# EAGLE design eTapper1main44 (EAGLE 8.4.3)
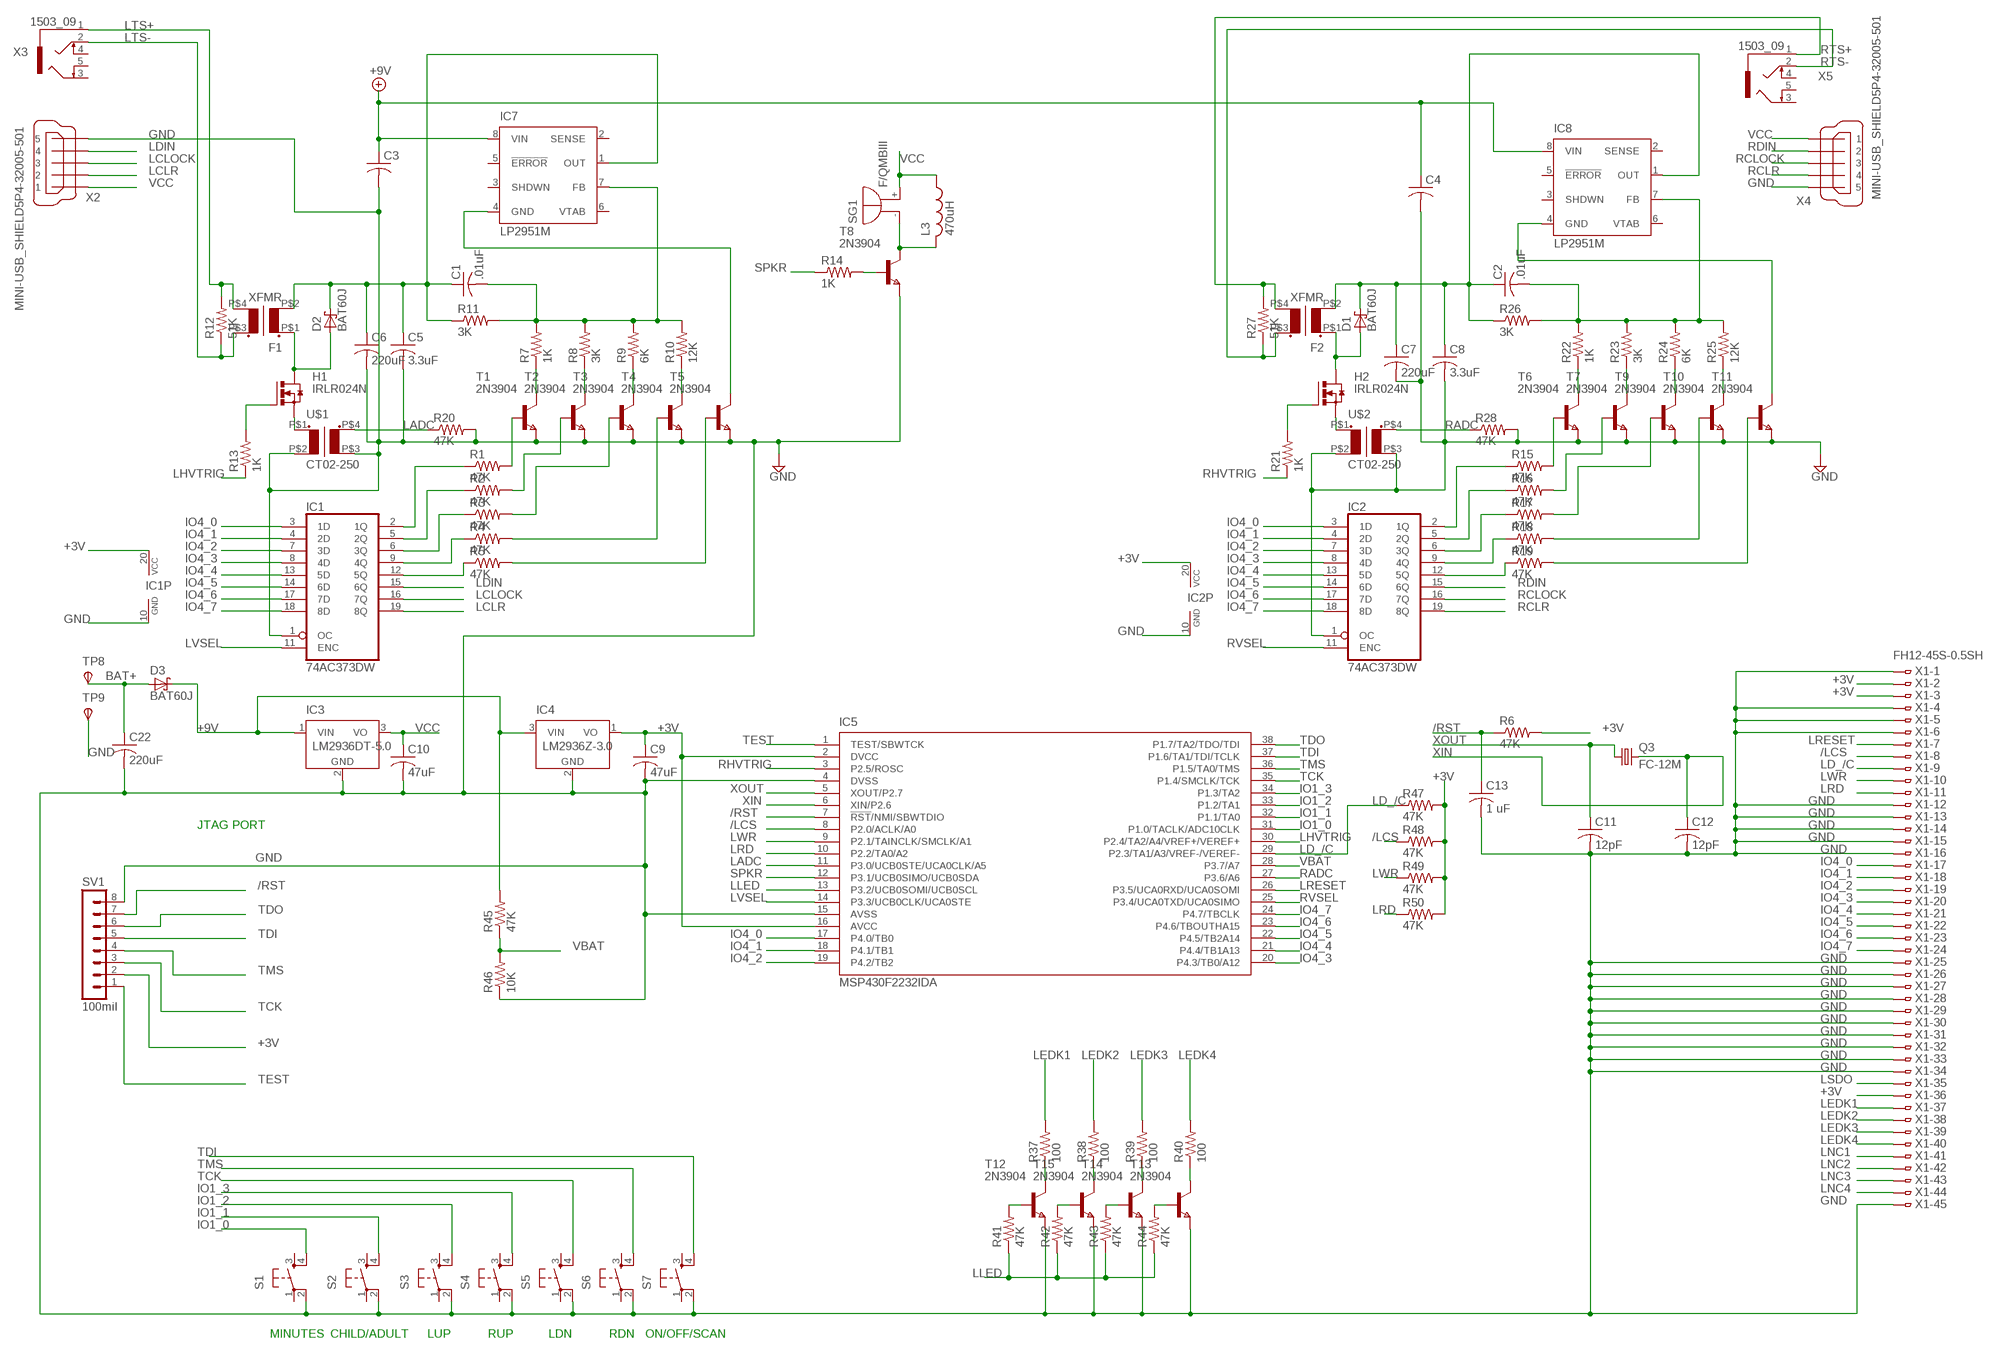
[diagram p0: schematic, sheet 1]

## Parts
C1  .01uF  C-USC0805  [C0805]
C2  .01uF  C-USC0805  [C0805]
C3  C-USC1206  [C1206]
C4  C-USC1206  [C1206]
C5  3.3uF  C-USC0805  [C0805]
C6  220uF  C-USC1206  [C1206]
C7  220uF  C-USC1206  [C1206]
C8  3.3uF  C-USC0805  [C0805]
C9  47uF  C-USC1206  [C1206]
C10  47uF  C-USC1206  [C1206]
C11  12pF  C-USC0805  [C0805]
C12  12pF  C-USC0805  [C0805]
C13  1 uF  C-USC0805  [C0805]
C22  220uF  C-USC1206  [C1206]
D1  BAT60J  [SOD323_ST]
D2  BAT60J  [SOD323_ST]
D3  BAT60J  [SOD323_ST]
F1  XFMR  [XFMR]
F2  XFMR  [XFMR]
H1  IRLR024N  [D-PAK_TO252AA]
H2  IRLR024N  [D-PAK_TO252AA]
IC1  74AC373DW  [SO20W]
IC2  74AC373DW  [SO20W]
IC3  LM2936DT-5.0  [TO252]
IC4  LM2936Z-3.0  [TO92]
IC5  MSP430F2232IDA  [TSSOP38_R-PDSO-G38-DA]
IC7  LP2951M  [SO08]
IC8  LP2951M  [SO08]
L3  470uH  L-USL2825P  [L2825P]
Q3  FC-12M  [FC-12M]
R1  47K  R-US_R0402  [R0402]
R2  47K  R-US_R0402  [R0402]
R3  47K  R-US_R0402  [R0402]
R4  47K  R-US_R0402  [R0402]
R5  47K  R-US_R0402  [R0402]
R6  47K  R-US_R0402  [R0402]
R7  1K  R-US_R0402  [R0402]
R8  3K  R-US_R0402  [R0402]
R9  6K  R-US_R0402  [R0402]
R10  12K  R-US_R0402  [R0402]
R11  3K  R-US_R0402  [R0402]
R12  51K  R-US_R0402  [R0402]
R13  1K  R-US_R0402  [R0402]
R14  1K  R-US_R0402  [R0402]
R15  47K  R-US_R0402  [R0402]
R16  47K  R-US_R0402  [R0402]
R17  47K  R-US_R0402  [R0402]
R18  47K  R-US_R0402  [R0402]
R19  47K  R-US_R0402  [R0402]
R20  47K  R-US_R0402  [R0402]
R21  1K  R-US_R0402  [R0402]
R22  1K  R-US_R0402  [R0402]
R23  3K  R-US_R0402  [R0402]
R24  6K  R-US_R0402  [R0402]
R25  12K  R-US_R0402  [R0402]
R26  3K  R-US_R0402  [R0402]
R27  51K  R-US_R0402  [R0402]
R28  47K  R-US_R0402  [R0402]
R37  100  R-US_R0402  [R0402]
R38  100  R-US_R0402  [R0402]
R39  100  R-US_R0402  [R0402]
R40  100  R-US_R0402  [R0402]
R41  47K  R-US_R0402  [R0402]
R42  47K  R-US_R0402  [R0402]
R43  47K  R-US_R0402  [R0402]
R44  47K  R-US_R0402  [R0402]
R45  47K  R-US_R0402  [R0402]
R46  10K  R-US_R0402  [R0402]
R47  47K  R-US_R0402  [R0402]
R48  47K  R-US_R0402  [R0402]
R49  47K  R-US_R0402  [R0402]
R50  47K  R-US_R0402  [R0402]
S1  10-XX  [B3F-10XX]
S2  10-XX  [B3F-10XX]
S3  10-XX  [B3F-10XX]
S4  10-XX  [B3F-10XX]
S5  10-XX  [B3F-10XX]
S6  10-XX  [B3F-10XX]
S7  10-XX  [B3F-10XX]
SG1  F/QMBIII  [F/QMBIII]
SV1  100mil  MA08-1  [MA08-1]
T1  2N3904  NPNSOT23  [SOT-23]
T2  2N3904  NPNSOT23  [SOT-23]
T3  2N3904  NPNSOT23  [SOT-23]
T4  2N3904  NPNSOT23  [SOT-23]
T5  2N3904  NPNSOT23  [SOT-23]
T6  2N3904  NPNSOT23  [SOT-23]
T7  2N3904  NPNSOT23  [SOT-23]
T8  2N3904  NPNSOT23  [SOT-23]
T9  2N3904  NPNSOT23  [SOT-23]
T10  2N3904  NPNSOT23  [SOT-23]
T11  2N3904  NPNSOT23  [SOT-23]
T12  2N3904  NPNSOT23  [SOT-23]
T13  2N3904  NPNSOT23  [SOT-23]
T14  2N3904  NPNSOT23  [SOT-23]
T15  2N3904  NPNSOT23  [SOT-23]
TP8  TPSPAD1-20  [P1-20]
TP9  TPSPAD1-20  [P1-20]
U$1  CT02-250  [CT02-250]
U$2  CT02-250  [CT02-250]
X1  FH12-45S-0.5SH  [FH12-45S-0.5SH]
X2  MINI-USB_SHIELD5P4-32005-501  [32005-501]
X3  1503_09  [1503_09]
X4  MINI-USB_SHIELD5P4-32005-501  [32005-501]
X5  1503_09  [1503_09]

## Nets
+3V [+3V]: C9.1 IC1.20(VCC) IC2.20(VCC) IC4.1(VO) IC5.2(DVCC) IC5.16(AVCC) R6.2 R47.2 R48.2 R49.2 R50.2 SV1.2 X1.2 X1.3 X1.36
+9V [+9V]: C3.1 C4.1 D3.C IC3.1(VIN) IC4.3(VIN) IC7.8(VIN) IC8.8(VIN) R45.2
/LCS: IC5.8(P2.0/ACLK/A0) R48.1 X1.8
/RST: C13.1 IC5.7(!RST!/NMI/SBWTDIO) R6.1 SV1.7
BAT+ [BAT+]: C22.1 D3.A TP8.TP(PP)
GND [GND]: C3.2 C4.2 C5.2 C6.2 C7.2 C8.2 C9.2 C10.2 C11.2 C12.2 C13.2 C22.2 IC1.1(OC) IC1.10(GND) IC2.1(OC) IC2.10(GND) IC3.2(GND) IC4.2(GND) IC5.4(DVSS) IC5.15(AVSS) R20.2 R28.2 R46.1 S1.2(P1) S2.2(P1) S3.2(P1) S4.2(P1) S5.2(P1) S6.2(P1) S7.2(P1) SV1.8 T1.2(E) T2.2(E) T3.2(E) T4.2(E) T5.2(E) T6.2(E) T7.2(E) T8.2(E) T9.2(E) T10.2(E) T11.2(E) T12.2(E) T13.2(E) T14.2(E) T15.2(E) TP9.TP(PP) U$1.P$2(P2) U$1.P$3(S2) U$2.P$2(P2) U$2.P$3(S2) X1.1 X1.4 X1.5 X1.6 X1.12 X1.13 X1.14 X1.15 X1.16 X1.25 X1.26 X1.27 X1.28 X1.29 X1.30 X1.31 X1.32 X1.33 X1.34 X1.45 X2.5 X4.5
IO1_0: IC5.31(P1.0/TACLK/ADC10CLK) S1.4(S1)
IO1_1: IC5.32(P1.1/TA0) S2.4(S1)
IO1_2: IC5.33(P1.2/TA1) S3.4(S1)
IO1_3: IC5.34(P1.3/TA2) S4.4(S1)
IO4_0: IC1.3(1D) IC2.3(1D) IC5.17(P4.0/TB0) X1.17
IO4_1: IC1.4(2D) IC2.4(2D) IC5.18(P4.1/TB1) X1.18
IO4_2: IC1.7(3D) IC2.7(3D) IC5.19(P4.2/TB2) X1.19
IO4_3: IC1.8(4D) IC2.8(4D) IC5.20(P4.3/TB0/A12) X1.20
IO4_4: IC1.13(5D) IC2.13(5D) IC5.21(P4.4/TB1A13) X1.21
IO4_5: IC1.14(6D) IC2.14(6D) IC5.22(P4.5/TB2A14) X1.22
IO4_6: IC1.17(7D) IC2.17(7D) IC5.23(P4.6/TBOUTHA15) X1.23
IO4_7: IC1.18(8D) IC2.18(8D) IC5.24(P4.7/TBCLK) X1.24
LADC: IC5.11(P3.0/UCB0STE/UCA0CLK/A5) R20.1 U$1.P$4(S1)
LCLOCK: IC1.16(7Q) X2.3
LCLR: IC1.19(8Q) X2.2
LD_/C: IC5.29(P2.3/TA1/A3/VREF-/VEREF-) R47.1 X1.9
LDIN: IC1.15(6Q) X2.4
LEDK1: R37.2 X1.37
LEDK2: R38.2 X1.38
LEDK3: R39.2 X1.39
LEDK4: R40.2 X1.40
LHVTRIG: IC5.30(P2.4/TA2/A4/VREF+/VEREF+) R13.1
LLED: IC5.13(P3.2/UCB0SOMI/UCB0SCL) R41.1 R42.1 R43.1 R44.1
LNC1: X1.41
LNC2: X1.42
LNC3: X1.43
LNC4: X1.44
LRD: IC5.10(P2.2/TA0/A2) R50.1 X1.11
LRESET: IC5.26(P3.5/UCA0RXD/UCA0SOMI) X1.7
LSDO: X1.35
LTS+: F1.P$4(S2) R12.2 X3.1
LTS-: F1.P$3(S1) R12.1 X3.2
LVSEL: IC1.11(ENC) IC5.14(P3.3/UCB0CLK/UCA0STE)
LWR: IC5.9(P2.1/TAINCLK/SMCLK/A1) R49.1 X1.10
N$1: IC1.2(1Q) R1.1
N$2: IC1.5(2Q) R2.1
N$3: IC1.6(3Q) R3.1
N$4: IC1.9(4Q) R4.1
N$5: IC1.12(5Q) R5.1
N$6: L3.2 SG1.-(+) T8.1(C)
N$7: R4.2 T4.3(B)
N$8: R5.2 T5.3(B)
N$9: D2.A F1.P$1(P1) H1.4(D)
N$10: R7.1 T1.1(C)
N$11: R8.1 T2.1(C)
N$12: R9.1 T3.1(C)
N$13: R1.2 T1.3(B)
N$14: R2.2 T2.3(B)
N$15: R3.2 T3.3(B)
N$16: R10.1 T4.1(C)
N$17: C1.2 IC7.7(FB) R7.2 R8.2 R9.2 R10.2 R11.2
N$18: C1.1 C5.1 C6.1 D2.C F1.P$2(P2) IC7.1(OUT) R11.1
N$19: D1.A F2.P$1(P1) H2.4(D)
N$20: IC2.2(1Q) R15.1
N$21: H1.1(G) R13.2
N$22: R14.2 T8.3(B)
N$23 [GND]: H1.3(S) U$1.P$1(P1)
N$24: IC2.5(2Q) R16.1
N$25: IC2.6(3Q) R17.1
N$26: IC2.9(4Q) R18.1
N$27: IC2.12(5Q) R19.1
N$28: R44.2 T13.3(B)
N$29: R15.2 T6.3(B)
N$30: R16.2 T7.3(B)
N$31: R17.2 T9.3(B)
N$32: R18.2 T10.3(B)
N$33: R19.2 T11.3(B)
N$35: R22.1 T6.1(C)
N$36: R23.1 T7.1(C)
N$37: R24.1 T9.1(C)
N$38: R25.1 T10.1(C)
N$39: C2.2 IC8.7(FB) R22.2 R23.2 R24.2 R25.2 R26.2
N$40: C2.1 C7.1 C8.1 D1.C F2.P$2(P2) IC8.1(OUT) R26.1
N$41: R37.1 T12.1(C)
N$42: H2.1(G) R21.2
N$43: R38.1 T15.1(C)
N$44: R39.1 T14.1(C)
N$45: IC7.4(GND) T5.1(C)
N$46: R40.1 T13.1(C)
N$47: IC8.4(GND) T11.1(C)
N$48: R43.2 T14.3(B)
N$49: R41.2 T12.3(B)
N$50: R42.2 T15.3(B)
N$51 [GND]: H2.3(S) U$2.P$1(P1)
RADC: IC5.27(P3.6/A6) R28.1 U$2.P$4(S1)
RCLOCK: IC2.16(7Q) X4.3
RCLR: IC2.19(8Q) X4.4
RDIN: IC2.15(6Q) X4.2
RHVTRIG: IC5.3(P2.5/ROSC) R21.1
RTS+: F2.P$4(S2) R27.2 X5.1
RTS-: F2.P$3(S1) R27.1 X5.2
RVSEL: IC2.11(ENC) IC5.25(P3.4/UCA0TXD/UCA0SIMO)
SPKR: IC5.12(P3.1/UCB0SIMO/UCB0SDA) R14.1
TCK: IC5.35(P1.4/SMCLK/TCK) S5.4(S1) SV1.3
TDI: IC5.37(P1.6/TA1/TDI/TCLK) S7.4(S1) SV1.5
TDO: IC5.38(P1.7/TA2/TDO/TDI) SV1.6
TEST: IC5.1(TEST/SBWTCK) SV1.1
TMS: IC5.36(P1.5/TA0/TMS) S6.4(S1) SV1.4
VBAT: IC5.28(P3.7/A7) R45.1 R46.2
VCC [VCC]: C10.1 IC3.3(VO) L3.1 SG1.+(-) X2.1 X4.1
XIN: C12.1 IC5.6(XIN/P2.6) Q3.2
XOUT: C11.1 IC5.5(XOUT/P2.7) Q3.1
Unconnected: IC7.2(SENSE) IC7.3(SHDWN) IC7.5(!ERROR) IC7.6(VTAB) IC8.2(SENSE) IC8.3(SHDWN) IC8.5(!ERROR) IC8.6(VTAB) S1.1(P) S1.3(S) S2.1(P) S2.3(S) S3.1(P) S3.3(S) S4.1(P) S4.3(S) S5.1(P) S5.3(S) S6.1(P) S6.3(S) S7.1(P) S7.3(S) X2.M1(S1) X2.M2(S2) X2.M3(S3) X2.M4(S4) X3.3 X3.4 X3.5 X4.M1(S1) X4.M2(S2) X4.M3(S3) X4.M4(S4) X5.3 X5.4 X5.5

## Notes on the sheet
- JTAG PORT
- MINUTES | CHILD/ADULT | LUP | RUP | LDN | RDN | ON/OFF/SCAN

## Library data of the parts
C1-C13 C22 = rcl:C-US: CAPACITOR, American symbol
D1-D3 = diode:BAT60J: Schottky barrier diode Source: www.st.com, BAT60J.pdf
F1 F2 = XFMR1:XFMR: Transformer 1"X1" 0.4"X0.4" hole separation for e_tapper
H1 H2 = IRLR024N:IRLR024N: IRLR024N HEXFET Power Mosfet N channel Infeneon Technology TO-251AA IPAK
IC1 IC2 = 74xx-eu:74*373: Octal D type transparent LATCH, edge triggered
IC3 = national-semiconductor:LM2936?*: Ultra-Low Quiescent Current LDO Voltage Regulator Source: Data sheet <http://www.national.com/ds/LM/LM2936.pdf>; MF: NATIONAL SEMICONDUCTOR; MPN: LM2936DT-5.0/NOPB; OC_FARNELL: 1286864; OC_NEWARK: 41K4501
IC4 = national-semiconductor:LM2936?*: Ultra-Low Quiescent Current LDO Voltage Regulator Source: Data sheet <http://www.national.com/ds/LM/LM2936.pdf>; MF: NATIONAL SEMICONDUCTOR; MPN: LM2936Z-3.0/NOPB; OC_FARNELL: 1312709; OC_NEWARK: 41K4531
IC5 = texas:MSP430F22*2IDA: MIXED SIGNAL MICROCONTROLLER Source: http://focus.ti.com/lit/ds/symlink/msp430f2274.pdf; MPN: MSP430F2232IDA; OC_FARNELL: 1610178; OC_NEWARK: 28M6312
IC7 IC8 = national-semiconductor:LP2951: Adjustable Micropower Voltage Regulator Source: http://www.national.com/ds/LP/LP2950.pdf; MF: FAIRCHILD SEMICONDUCTOR; MPN: LP2951CM; OC_FARNELL: 9488561; OC_NEWARK: 78K6014
L3 = rcl:L-US: INDUCTOR, American symbol
Q3 = crystal:FC-12M: kHz RANGE CRYSTAL UNIT LOW PROFILE SMD Source: Epson Toyocom FC-12M.pdf
R1-R28 R37-R50 = resistor:R-US_: RESISTOR, American symbol
S1-S7 = switch-omron:10-XX: OMRON SWITCH; MPN: B3F-1000; OC_FARNELL: 176432; OC_NEWARK: 36M3542
SG1 = buzzer:F/QMBIII: BUZZER Source: Buerklin; OC_FARNELL: unknown; OC_NEWARK: unknown
SV1 = con-lstb:MA08-1: PIN HEADER; OC_FARNELL: unknown; OC_NEWARK: unknown
T1-T15 = zetex:NPNSOT23: NPN TRANSISTOR; MPN: DSS20201L-7; OC_FARNELL: 1710688; OC_NEWARK: 25R4555
TP8 TP9 = testpad:TPS: TEST PIN
U$1 U$2 = CT02-250:CT02-250: Current Transformer ICE Components 1:250 turns ratio
X1 = con-hirose:FH12-45S-0.5S: 0.5mm Pitch Connectors For FPC/FFC Source: Data sheet <http://www.hirose.co.jp/cataloge_hp/e58605370.pdf>; OC_FARNELL: unknown; OC_NEWARK: unknown
X2 X4 = con-cypressindustries:MINI-USB_SHIELD5P4-: MINI USB-B R/A W/O POST 5 pol. Source: www.cypressindustries.com; OC_FARNELL: unknown; OC_NEWARK: unknown
X3 X5 = con-lumberg:1503_09: Jack connectors according to JISC 6560, 3.5 mm Klinkeneinbaukupplung nach JISC 6560, 3,5 mm, 3-polig/ stereo, abgewinkelte Ausführung, mit 2 Öffnern und Lötaugen, für Leiterplatten Rückseitenmontage Source: http://www.lumberg.com/Produkte/PDFs/1503_09.pdf; OC_FARNELL: 1243244; OC_NEWARK: unknown

## Module LP2951
Ports: 

### Library data of the parts

## Net classes
1 GND: width 0.305 mm, clearance 0.152 mm
2 BAT+: width 0.305 mm, clearance 0.152 mm
3 +9V: width 0.305 mm, clearance 0.152 mm
4 +3V: width 0.305 mm, clearance 0.152 mm
5 VCC: width 0.305 mm, clearance 0.152 mm

## Board
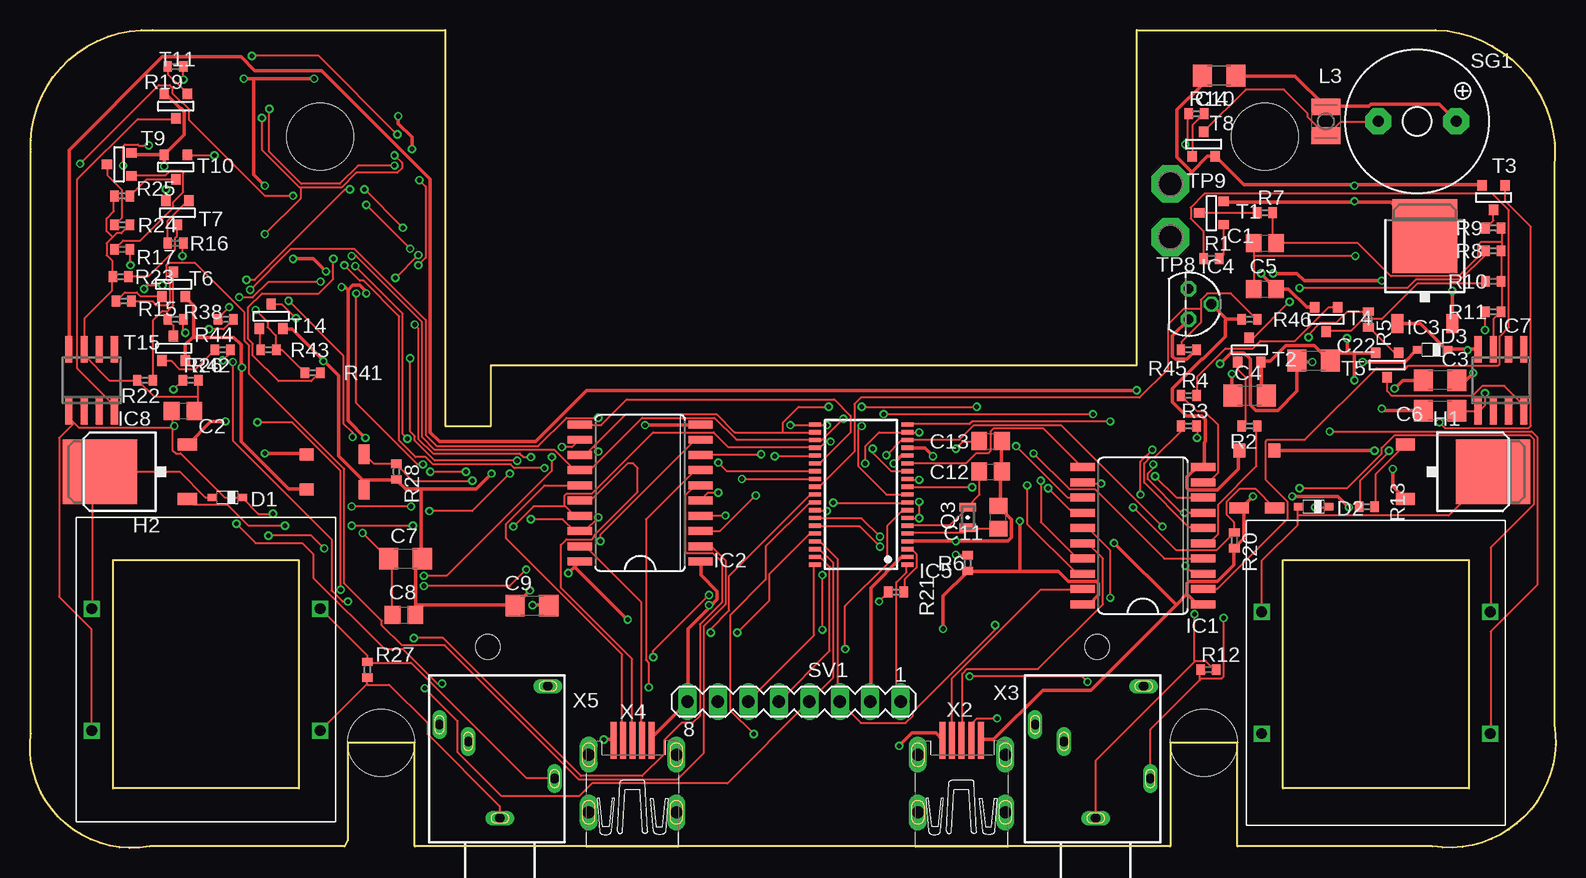
[diagram p1: board, top side]
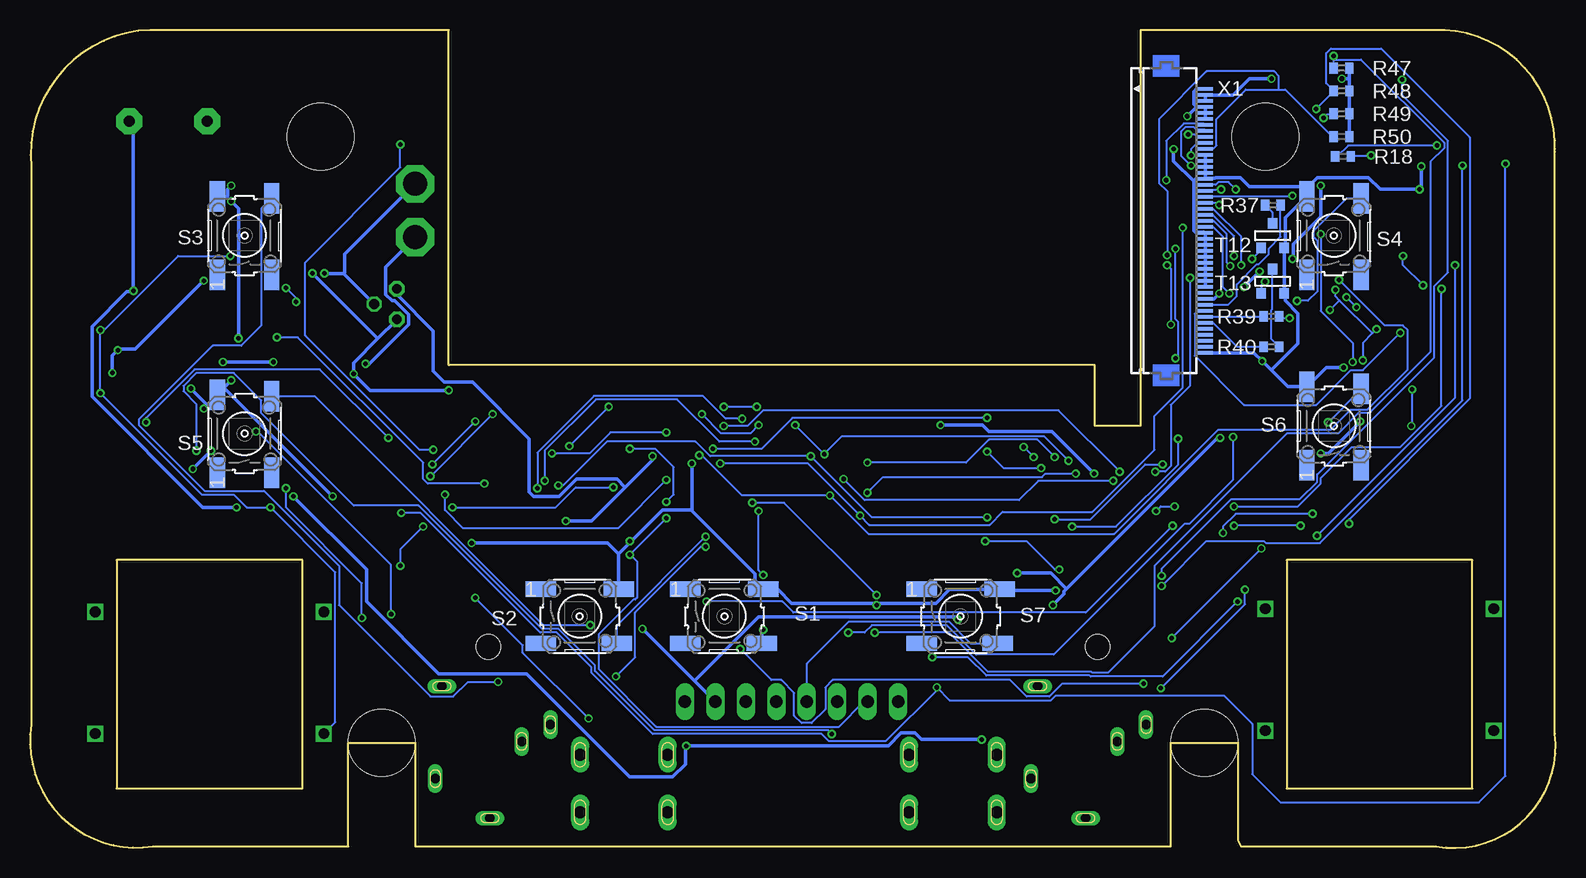
[diagram p2: board, bottom side, seen from below]

Size 127.17 x 68.21 mm. Coordinates in mm from the lower left corner, seen from the top.
Outline: 0.06,58.04 0.06,58.3 0.06,9.53
Outline: 0.06,58.04 0.06,9.53
Outline: 0.06,58.04 arc-96 10.22,68.2 34.61,68.2 34.61,35.18 38.42,35.18 38.42,40.26 92.27,40.26 92.27,68.2 117.16,68.2 arc-94 127.06,56.77 127.06,10.29 arc-108 116.9,0.13 100.65,0.13 100.65,8.77 95.06,8.77 95.06,0.13 32.07,0.13 32.07,8.77 26.48,8.77 26.48,0.64 26.23,0.13 9.97,0.13 arc-107 0.06,9.53
Outline: 104.46,24.01 119.95,24.01 119.95,4.96 104.46,4.96 104.46,24.01
Outline: 6.92,24.01 22.42,24.01 22.42,4.96 6.92,4.96 6.92,24.01
Copper layers (1*16): Top 0.035mm / dielectric 30mil / Bottom 0.035mm
Design rules "default *": minimum track width 6mil, minimum drill 15mil, track to track 6mil, track to pad 6mil, pad to pad 6mil, via to via 6mil, smd to smd 6mil, copper to edge 40mil, drill to drill 6mil, minimum pad ring 6mil, minimum via ring 6mil, stop-mask expansion 4mil, vias tented up to drill 0mil, thermal gap 10mil
Holes 5.59 mm at 24.19,59.31 102.93,59.31 29.27,8.77 97.85,8.77
Holes 2.03 mm at 38.16,16.77 88.96,16.77

### Footprints (pad centres in the part's own frame; a part is rotated, then mirrored left to right if it is on the bottom)
C0805 = smd 1.3 x 1.5: 1 -0.95,0; 2 0.95,0
C1206 = smd 1.6 x 1.8: 1 -1.4,0; 2 1.4,0
SOD323_ST = smd 0.8 x 0.6: A 1.25,0; C -1.25,0
XFMR = drill 0.889 square: P$1 -10.16,5.08; P$2 -10.16,-5.08; P$3 8.89,5.08; P$4 8.89,-5.08
D-PAK_TO252AA = smd 1 x 1.6: 1 -2.28,-4.8; 3 2.28,-4.8 | smd 5.4 x 6.2: 4 0,2.5
SO20W = smd 0.66 x 2.032: 1 -5.715,-5.029; 2 -4.445,-5.029; 3 -3.175,-5.029; 4 -1.905,-5.029; 5 -0.635,-5.029; 6 0.635,-5.029; 7 1.905,-5.029; 8 3.175,-5.029; 9 4.445,-5.029; 10 5.715,-5.029; 11 5.715,5.029; 12 4.445,5.029; 13 3.175,5.029; 14 1.905,5.029; 15 0.635,5.029; 16 -0.635,5.029; 17 -1.905,5.029; 18 -3.175,5.029; 19 -4.445,5.029; 20 -5.715,5.029
TO252 = smd 1 x 1.6: 1 -2.28,-4.8; 3 2.28,-4.8 | smd 5.4 x 6.2: 2 0,2.5
TO92 = drill 0.813 pad 1.27 octagon: 1 -1.27,0; 2 0,1.905; 3 1.27,0
TSSOP38_R-PDSO-G38-DA = smd 0.35 x 1: 1 -5.85,-3.85; 2 -5.2,-3.85; 3 -4.55,-3.85; 4 -3.9,-3.85; 5 -3.25,-3.85; 6 -2.6,-3.85; 7 -1.95,-3.85; 8 -1.3,-3.85; 9 -0.65,-3.85; 10 0,-3.85; 11 0.65,-3.85; 12 1.3,-3.85; 13 1.95,-3.85; 14 2.6,-3.85; 15 3.25,-3.85; 16 3.9,-3.85; 17 4.55,-3.85; 18 5.2,-3.85; 19 5.85,-3.85; 20 5.85,3.85; 21 5.2,3.85; 22 4.55,3.85; 23 3.9,3.85; 24 3.25,3.85; 25 2.6,3.85; 26 1.95,3.85; 27 1.3,3.85; 28 0.65,3.85; 29 0,3.85; 30 -0.65,3.85; 31 -1.3,3.85; 32 -1.95,3.85; 33 -2.6,3.85; 34 -3.25,3.85; 35 -3.9,3.85; 36 -4.55,3.85; 37 -5.2,3.85; 38 -5.85,3.85
SO08 = smd 0.6 x 2.2: 1 -1.905,-2.6; 2 -0.635,-2.6; 3 0.635,-2.6; 4 1.905,-2.6; 5 1.905,2.6; 6 0.635,2.6; 7 -0.635,2.6; 8 -1.905,2.6
L2825P = smd 1.4 x 2.4: 1 -1.2,0; 2 1.2,0
FC-12M = smd 0.7 x 1.4: 1 -0.85,0; 2 0.85,0
R0402 = smd 0.7 x 0.9: 1 -0.65,0; 2 0.65,0
B3F-10XX = smd 2.54 x 1.27: 1 -3.251,2.261; 2 3.251,2.261; 3 -3.251,-2.261; 4 3.099,-2.261
F/QMBIII = drill 0.914 pad 2.159 octagon: + 3.251,0; - -3.251,0
MA08-1 = drill 1.016 long: 1 -8.89,0; 2 -6.35,0; 3 -3.81,0; 4 -1.27,0; 5 1.27,0; 6 3.81,0; 7 6.35,0; 8 8.89,0
SOT-23 = smd 0.787 x 0.889: 1 0.025,-1.016; 2 -0.94,1.016; 3 0.991,1.016
P1-20 = drill 2.007 pad 3.15 octagon: TP 0,0
CT02-250 = smd 1 x 1.2: P$1 -1.45,-2.4; P$2 1.5,-2.4 | smd 1.6 x 0.9: P$3 1.5,2.4; P$4 -1.45,2.4
FH12-45S-0.5SH = smd 0.3 x 1.3: 1 -13,3.25; 2 -12.5,3.25; 3 -12,3.25; 4 -11.5,3.25; 5 -11,3.25; 6 -10.5,3.25; 7 -10,3.25; 8 -9.5,3.25; 9 -9,3.25; 10 -8.5,3.25; 11 -8,3.25; 12 -7.5,3.25; 13 -7,3.25; 14 -6.5,3.25; 15 -6,3.25; 16 -5.5,3.25; 17 -5,3.25; 18 -4.5,3.25; 19 -4,3.25; 20 -3.5,3.25; 21 -3,3.25; 22 -2.5,3.25; 23 -2,3.25; 24 -1.5,3.25; 25 -1,3.25; 26 -0.5,3.25; 27 0,3.25; 28 0.5,3.25; 29 1,3.25; 30 1.5,3.25; 31 2,3.25; 32 2.5,3.25; 33 3,3.25; 34 3.5,3.25; 35 4,3.25; 36 4.5,3.25; 37 5,3.25; 38 5.5,3.25; 39 6,3.25; 40 6.5,3.25; 41 7,3.25; 42 7.5,3.25; 43 8,3.25; 44 8.5,3.25; 45 9,3.25
32005-501 = smd 3.1 x 0.5: 1 3,1.6; 2 3,0.8; 3 3,0; 4 3,-0.8; 5 3,-1.6 | drill 1 pad 1.422 long: M1 -3,3.65; M2 -3,-3.65; M3 1.8,3.65; M4 1.8,-3.65
1503_09 = drill 0.8 pad 1.2 long: 1 0,-2.1; 2 -4.55,-5.4; 3 5.05,-9.9; 4 -4,-13.1; 5 2.65,-8.5

### Placement (x,y rotation side)
C1  102.93,50.42 0 top
C2  12.76,36.45 0 top
C3  117.54,38.99 180 top
C4  101.66,37.72 0 top
C5  102.93,46.61 0 top
C6  117.54,36.45 180 top
C7  31.31,24.14 0 top
C8  31.18,19.44 0 top
C9  41.85,20.2 180 top
C10  99.12,64.39 180 top
C11  80.71,27.56 90 top
C12  80.07,31.37 0 top
C13  80.07,33.91 0 top
C22  107,40.65 0 top
D1  16.45,29.22 180 top
D2  107,28.45 180 top
D3  116.9,41.53 180 top
F1  112.84,14.61 0 top
F2  15.3,14.86 0 top
H1  119.44,31.37 270 top
H2  8.32,31.37 90 top
IC1  92.77,26.04 90 top
IC2  50.86,29.6 90 top
IC3  116.27,48.52 0 top
IC4  96.58,45.34 270 top
IC5  69.28,29.47 90 top
IC7  122.62,38.99 0 top
IC8  5.14,38.99 0 top
L3  108.01,60.58 270 top
Q3  78.17,27.56 90 top
R1  98.49,49.15 0 top
R2  101.66,35.18 180 top
R3  96.58,35.18 0 top
R4  96.58,37.72 0 top
R5  111.57,44.07 270 top
R6  78.17,23.75 270 top
R7  102.93,52.96 0 top
R8  121.98,49.79 0 top
R9  121.98,51.69 0 top
R10  121.98,47.25 0 top
R11  121.98,44.71 0 top
R12  98.23,14.86 0 top
R13  111.44,28.45 0 top
R14  97.22,61.22 0 top
R15  7.81,45.6 180 top
R16  12.13,50.42 180 top
R17  7.68,49.92 180 top
R18  17.72,57.66 0 bottom
R19  12.13,65.16 180 top
R20  100.39,25.66 270 top
R21  72.2,21.34 180 top
R22  9.59,38.99 180 top
R23  7.56,47.63 180 top
R24  7.68,51.95 0 top
R25  7.68,54.36 180 top
R26  13.4,38.99 0 top
R27  28.13,14.86 270 top
R28  30.54,31.37 270 top
R37  23.56,53.6 0 bottom
R38  12.13,44.07 0 top
R39  23.69,44.33 180 bottom
R40  23.69,41.79 180 bottom
R41  23.56,39.63 0 top
R42  16.07,41.53 180 top
R43  19.88,41.53 180 top
R44  16.32,44.07 180 top
R45  96.58,41.53 0 top
R46  101.66,44.07 0 top
R47  17.84,65.03 0 bottom
R48  17.84,63.12 0 bottom
R49  17.84,61.22 0 bottom
R50  17.84,59.31 0 bottom
S1  69.28,19.31 0 bottom
S2  81.34,19.31 0 bottom
S3  109.28,51.06 90 bottom
S4  18.48,51.06 90 bottom
S5  109.28,34.55 90 bottom
S6  18.48,35.18 90 bottom
S7  49.59,19.31 0 bottom
SG1  115.63,60.58 0 top
SV1  63.69,12.2 180 top
T1  98.49,52.96 270 top
T2  101.66,41.53 180 top
T3  121.98,54.23 0 top
T4  108.01,44.07 0 top
T5  113.09,40.26 0 top
T6  12,47 180 top
T7  12.26,52.96 0 top
T8  97.85,58.68 180 top
T9  7.43,57.03 270 top
T10  12.13,56.77 0 top
T11  12.13,61.85 0 top
T12  23.56,51.06 180 bottom
T13  23.56,47.25 180 bottom
T14  20.13,44.33 180 top
T15  12,41.66 180 top
TP8  95.06,50.93 0 top
TP9  95.06,55.38 0 top
U$1  102.3,30.74 180 top
U$2  25.46,31.37 270 top
X1  32.45,50.3 270 bottom
X2  77.66,5.97 90 top
X3  88.84,0.39 180 top
X4  50.23,5.97 90 top
X5  39.18,0.39 180 top

### Tracks (layer width: path | path; a pad name or v marks a point on that pad's centre or on a via)
+3V  (via drill 0.38)
  Top 0.305: IC5.2 73.06,24.21 72.61,24.21 70.09,21.7 70.09,12.25 SV1.2 | 82.51,23.07 85.71,23.07 86.55,22.23 88.91,22.23 89.07,22.08 89.07,21.09 88.3,20.33 IC1.20 | 82.51,23.07 78.17,23.07 R6.2 78.09,22.99 76.11,21.01 v76.11,18.27 | v75.27,32.67 74.59,33.36 73.14,33.36 IC5.16 | 82.51,23.07 v82.51,27.26 | v17.82,64.14 18.66,64.14 | 18.66,64.14 v23.69,64.14 | v28.03,46.23 28.03,46.39 27.5,46.92 26.89,46.92 26.5,46.54 | 26.5,46.54 26.5,35.64 v27.95,34.19 | v41.9,20.25 43.19,20.25 C9.1 | v44.87,22.92 45.4,23.45 | 45.4,23.45 IC2.20 | 18.66,64.14 18.66,56.14 v19.57,55.23 | v21.93,49.13 23.61,49.13 v24.68,48.06 | v25.97,46.77 26.28,46.77 26.5,46.54 | 45.4,23.45 v49.82,19.03
  Bottom 0.305: v75.27,32.67 75.27,32.37 77.56,30.08 | 77.56,30.08 80.38,27.26 v82.51,27.26 | 77.56,30.08 78.24,30.76 81.6,30.76 83.05,29.32 85.18,29.32 85.56,29.7 85.56,34.12 90.28,38.84 92.65,38.84 93.56,39.76 93.56,43.11 96.53,46.08 96.53,46.61 IC4.1 | v76.11,18.27 71.77,13.92 | 71.77,13.92 SV1.2 | X1.3 29.17,62.31 29.17,62.77 X1.2 29.02,62.77 26.89,62.77 25.51,64.14 v23.69,64.14 | R50.2 17.21,59.34 17.21,61.17 R49.2 17.21,61.32 17.21,63.07 R48.2 17.21,63.23 17.21,64.14 | 17.21,64.14 17.21,64.98 R47.2 | 17.21,64.14 v17.82,64.14 | v28.03,46.23 28.49,45.78 29.17,45.78 X1.36 | v27.95,34.19 28.18,34.19 40.75,21.62 | 40.75,21.62 40.98,21.39 40.98,21.16 v41.9,20.25 | v44.87,22.92 42.05,22.92 40.75,21.62 | v19.57,55.23 19.57,52.63 21.86,50.35 21.86,49.21 v21.93,49.13 | v25.97,46.77 v24.68,48.06 | 71.77,13.92 66.43,19.26 50.05,19.26 v49.82,19.03
+9V  (via drill 0.38)
  Top 0.305: 119.85,41.59 120.69,41.59 IC7.8 | 119.85,41.59 118.17,41.59 D3.C 118.02,41.59 115.89,43.72 114.06,43.72 IC3.1 | C3.1 119.7,38.99 v120.31,39.6 | v119.85,41.51 119.85,41.59 | IC4.3 95.24,42.73 95.24,40.98 95.47,40.75 96.46,40.75 97.22,41.51 R45.2 | v100.19,39.53 100.19,37.78 C4.1 | v92.27,38.16 46.39,38.16 42.13,33.89 34.12,33.89 33.36,34.65 33.36,55.76 24.3,64.83 18.73,64.83 17.59,65.97 11.04,65.97 3.26,58.2 3.26,41.66 IC8.8 | v112.69,47.3 106.21,47.3 105.6,47.91 v103.62,47.91
  Bottom 0.305: v120.31,39.6 120.31,41.05 v119.85,41.51 119.77,41.59 118.4,41.59 v112.69,47.3 | 98.17,42.46 96.61,44.02 IC4.3 | 98.17,42.46 100.19,40.44 v100.19,39.53 98.82,38.16 v92.27,38.16 | 98.17,42.46 v103.62,47.91
/LCS  (via drill 0.38)
  Top 0.152: v19.95,61.63 19.95,58.04 22.62,55.38 25.82,55.38 27.34,56.9 v30.39,56.9 | v67.96,16.59 67.96,20.17 71.46,23.68 71.46,26.88 72.68,28.1 73.06,28.1 IC5.8 | v34.35,13.7 33.97,13.7 31.08,16.59 29.55,16.59 23.61,22.54 23.61,24.52 22.69,25.43 18.81,25.43 v17.21,27.03
  Bottom 0.152: v19.95,61.63 18.5,63.07 R48.1 18.5,63.15 19.11,63.76 19.11,66.27 18.73,66.66 14.54,66.66 7.15,59.26 7.15,37.47 17.21,27.41 v17.21,27.03 | v30.39,56.9 31.23,57.74 31.23,59.72 30.85,60.1 30.16,60.1 29.93,59.87 29.25,59.87 X1.8 | v67.96,16.59 65.37,14 64.53,14 63.46,12.93 63.46,11.03 62.85,10.42 62.01,10.42 60.87,11.56 60.87,13.39 60.26,14 45.48,14 44.11,12.63 42.2,12.63 41.14,13.7 v34.35,13.7
/RST  (via drill 0.38)
  Top 0.152: v77.18,24.44 78.17,24.44 R6.1 | IC5.7 73.14,27.49 v74.13,27.49 v74.13,28.86 | v77.18,33.28 77.79,33.89 79.08,33.89 C13.1
  Bottom 0.152: v74.13,27.49 v77.18,24.44 77.1,24.44 76.57,23.91 76.57,20.86 76.72,20.71 76.87,20.71 79.77,17.81 79.77,14.92 74.97,10.11 59.73,10.11 57.67,12.17 57.37,12.17 SV1.7 | v77.18,33.28 75.04,33.28 73.52,31.76 73.52,29.47 v74.13,28.86
BAT+  (via drill 0.38)
  Top 0.305: v111.09,40.52 114.59,40.52 115.58,41.51 D3.A | v106.9,40.52 105.68,40.52 105.6,40.59 C22.1 105.6,40.44 105.6,38.08 104,36.48 102.17,36.48 101.71,36.94 101.71,40.75 101.18,41.28 100.11,41.28 v99.2,40.37
  Bottom 0.305: v106.9,40.52 v111.09,40.52 | v99.2,40.37 98.89,40.37 95.62,43.64 95.62,44.48 96.76,45.62 96.99,45.62 97.52,46.16 97.52,48.44 95.08,50.88 TP8.TP
GND  (via drill 0.38)
  Top 0.305: IC1.1 97.29,20.33 96.46,21.16 | 96.46,21.16 96.46,22.08 96.61,22.23 98.97,22.23 100.34,23.6 100.34,24.9 R20.2 100.42,25.05 101.18,25.81 101.18,27.95 100.8,28.33 U$1.P$3 100.95,28.33 v101.94,29.32 | 96.46,21.16 95.54,20.25 | 95.54,20.25 88.46,13.16 84.42,13.16 80.3,9.05 79.31,9.05 X2.5 | v112.69,36.63 112.84,36.48 116.12,36.48 C6.2 | C3.2 114.44,38.99 v113.75,38.31 | C4.2 103.01,37.78 102.63,38.16 102.63,40.52 T2.2 102.7,40.59 103.39,40.59 104.69,41.89 107.05,41.89 108.27,40.67 C22.2 108.42,40.67 109.03,41.28 109.79,41.28 | 109.79,41.28 110.4,41.28 | 110.4,41.28 T5.2 | 110.4,41.28 v110.4,38.99 | 110.4,53.85 113.45,53.85 116.27,51.03 IC3.2 | 110.4,53.85 99.5,53.85 T1.2 | v110.4,53.93 110.4,53.85 | v109.79,42.5 109.79,41.28 | U$1.P$2 100.72,33.13 100.72,31.6 98.97,29.85 96.61,29.85 96.46,30 96.46,30.92 97.29,31.76 IC1.10 97.9,31.83 97.9,33.81 97.98,33.89 97.98,35.72 97.68,36.02 96.38,36.02 95.24,37.17 95.24,38.31 97.68,40.75 97.75,40.75 99.66,42.65 99.66,44.02 99.73,44.1 | T4.2 106.44,45.09 104.91,46.61 C5.2 103.77,46.69 102.63,47.83 v102.63,47.91 | 99.73,44.1 100.95,44.1 R46.1 | IC4.2 99.73,44.1 | 96.84,56.37 95.85,55.38 TP9.TP | 96.84,56.37 98.13,57.66 T8.2 98.89,57.59 101.18,55.3 110.4,55.3 | 110.4,55.3 120.99,55.3 T3.2 | 96.84,56.37 95.62,57.59 95.62,61.55 97.68,63.61 97.68,64.37 C10.2 | v110.4,55.23 110.4,55.3 | 56.68,20.1 54.85,18.27 54.85,12.25 SV1.8 51.88,9.28 51.88,9.05 X4.5 | 56.68,20.1 57.29,20.71 57.29,21.39 55.92,22.76 55.92,23.83 IC2.1 | C13.2 80.99,33.89 80.99,31.37 C12.2 80.91,31.3 80.91,28.78 80.76,28.63 C11.2 80.76,28.48 81.83,27.41 81.83,25.89 81.52,25.58 v77.18,25.58 73.14,25.58 IC5.4
  Top 0.305: v72,32.06 72.61,32.67 73.06,32.67 IC5.15 | v56.6,20.25 56.6,20.17 56.68,20.1 | T15.2 12.94,41.97 13.63,42.65 | 13.63,42.65 13.63,45.24 12.94,45.93 T6.2 | 17.59,40.06 17.59,41.97 16.98,42.58 13.7,42.58 13.63,42.65 | 17.59,40.06 17.59,33.89 21.55,29.93 23,29.93 U$2.P$2 | v30.7,61.02 30.7,60.41 31.84,59.26 v31.84,58.27 | T9.2 8.6,57.82 11.19,57.82 T10.2 | T11.2 11.19,62.85 11.34,62.85 12.56,61.63 12.64,61.63 12.87,61.4 12.87,59.49 11.26,57.89 T10.2 | v11.34,54.92 11.34,54.01 T7.2 | v11.19,56.83 T10.2 | v17.67,40.06 17.59,40.06 | 32.14,20.25 32.14,23.6 32.68,24.14 C7.2 32.6,24.21 32.6,29.93 | 32.14,20.25 32.14,19.49 C8.2 | 32.14,20.25 40.37,20.25 C9.2 40.53,20.33 v41.67,21.47 | 24.49,40.63 25.74,39.38 25.74,32.67 27.8,30.61 | 24.49,40.63 21.86,43.26 21.09,43.26 T14.2 | 27.8,30.61 27.8,29.93 U$2.P$3 | 27.8,30.61 27.88,30.69 30.54,30.69 R28.2 30.62,30.61 31.31,29.93 32.6,29.93 | v51.27,35.26 55.84,35.26 IC2.10 | v38.47,31.22 37.17,29.93 32.6,29.93 | v24.45,40.59 24.49,40.63 | v90.36,25.43 95.54,20.25
  Bottom 0.305: 112.38,36.94 111.54,37.78 S5.2 | 112.38,36.94 v112.69,36.63 | 112.38,36.94 v113.75,38.31 | v110.4,38.99 111.47,37.93 S5.2 | 110.78,54.31 S3.2 | 110.78,54.31 v110.4,53.93 109.79,53.32 v109.79,42.5 | 101.03,47.91 v102.63,47.91 | 101.03,47.91 98.51,45.4 IC4.2 | 101.03,47.91 100.95,47.99 100.95,49.51 95.08,55.38 TP9.TP | v110.4,55.23 110.71,54.92 110.71,54.39 110.78,54.31 | v101.94,29.32 110.93,38.31 S5.2 | 72,28.17 72,28.1 66.74,22.84 66.74,22.31 66.05,21.62 S1.2 65.9,21.54 64.83,21.54 63.69,20.4 56.6,20.4 | 72,28.17 v72,32.06 | 56.6,20.4 51.65,20.4 50.51,21.54 46.39,21.54 S7.2 46.24,21.47 v41.67,21.47 | 78.09,24.52 S2.2 | 77.1,25.51 74.43,28.17 72,28.17 | 77.1,25.51 78.09,24.52 | v77.18,25.58 77.1,25.51 | v56.6,20.25 56.6,20.4 | X1.6 29.17,60.86 29.17,61.24 X1.5 29.17,61.4 29.17,61.78 X1.4 29.32,61.78 29.93,61.78 | 29.93,61.78 30.16,62.01 30.16,63.07 29.93,63.3 29.25,63.3 X1.1 | X1.16 29.17,55.83 29.17,56.29 X1.15 29.17,56.44 29.17,56.75 X1.14 29.17,56.9 29.17,57.28 X1.13 29.17,57.43 29.17,57.74 X1.12 | X1.34 29.17,46.84 29.17,47.22 X1.33 29.17,47.45 29.17,47.76 X1.32 29.17,47.91 29.17,48.29 X1.31 29.17,48.44 29.17,48.75 X1.30 29.17,48.9 29.17,49.28 X1.29 29.17,49.43 29.17,49.74 X1.28 29.17,49.89 29.17,50.27 X1.27 29.17,50.42 29.17,50.73 X1.26 29.17,50.88 29.17,51.26 X1.25 29.32,51.34 30.01,51.34 30.16,51.49 30.16,55.61 | 30.16,55.61 30.01,55.76 29.32,55.76 X1.16 | v30.7,61.02 29.93,61.78 | v31.84,58.27 31.84,57.28 30.16,55.61 | 23.69,39.83 22.31,38.46 20.79,38.46 S6.2 19.11,40.06 v17.67,40.06 | 23.69,39.83 v24.45,40.59 25.13,41.28 29.17,41.28 X1.45 | S4.2 20.71,54.31 20.71,55.07 19.88,55.91 15.61,55.91 14.62,54.92 v11.34,54.92 11.19,55.07 v11.19,56.83
  Bottom 0.305: S4.2 20.87,54.23 22.54,52.56 22.54,50.12 T12.2 T13.2 22.54,46.16 22.54,45.62 21.48,44.56 21.48,42.04 23.69,39.83 | X1.16 29.02,55.83 28.41,55.83 28.33,55.91 26.28,55.91 25.51,55.15 20.79,55.15 S4.2 | v51.27,35.26 47.76,35.26 47.23,34.73 41.97,34.73 v38.47,31.22 | v90.36,25.43 79.01,25.43 78.09,24.52
IO1_0  (via drill 0.38)
  Top 0.152: v66.43,28.1 65.44,28.1 IC5.31 | v66.05,18.19 v66.05,22.76
  Bottom 0.152: v66.43,28.1 66.43,23.14 v66.05,22.76 | v66.05,18.19 66.05,17.13 66.13,17.05 S1.4
IO1_1  (via drill 0.38)
  Top 0.152: v70.85,25.96 69.33,27.49 65.44,27.49 IC5.32
  Bottom 0.152: v70.85,25.96 78.24,18.57 S2.4
IO1_2  (via drill 0.38)
  Top 0.152: v70.85,25.13 69.18,26.8 65.44,26.8 IC5.33 | v78.32,14.31 87.69,14.31 v88.15,13.85
  Bottom 0.152: v70.85,25.13 71.23,25.13 76.72,19.64 76.72,15.91 v78.32,14.31 | v88.15,13.85 90.67,13.85 91.88,12.63 93.79,12.63 101.41,20.25 101.41,23.53 107.66,29.77 112.61,29.77 118.1,35.26 118.1,35.72 111.93,41.89 109.56,41.89 107.89,43.57 107.89,53.32 107.05,54.16 S3.4
IO1_3  (via drill 0.38)
  Top 0.152: v58.97,17.96 61.63,20.63 61.63,22.84 64.99,26.19 65.37,26.19 IC5.34 | v26.89,34.27 26.89,34.65 26.12,35.41 26.12,41.05 v21.55,45.62
  Bottom 0.152: v58.97,17.96 57.59,17.96 56.98,18.57 50.74,18.57 48.3,16.13 41.82,16.13 30.92,27.03 30.54,27.03 26.89,30.69 v26.89,34.27 | v21.55,45.62 20.64,45.62 19.88,46.39 19.88,50.65 20.18,50.96 20.18,51.42 17.44,54.16 S4.4
IO4_0  (via drill 0.38)
  Top 0.152: v71.39,32.75 72.61,33.97 73.06,33.97 IC5.17 73.14,34.04 77.48,34.04 78.7,35.26 85.94,35.26 v94.4,26.8 | v60.49,29.39 57.52,26.42 IC2.3 | v26.66,54.92 26.28,54.92 18.73,47.38 v18.05,47.38 | v96.3,23.53 96.91,22.92 97.75,22.92 IC1.3
  Bottom 0.152: v71.39,32.75 71.16,32.75 67.81,29.39 v60.49,29.39 57.29,26.19 36.79,26.19 28.11,34.88 18.73,34.88 17.06,36.56 15.68,36.56 12.33,39.91 12.33,43.19 12.71,43.57 14.24,43.57 v18.05,47.38 | v26.66,54.92 27.27,55.53 28.11,55.53 28.33,55.3 29.17,55.3 X1.17 | v96.3,23.53 96.3,24.9 v94.4,26.8
IO4_1  (via drill 0.38)
  Top 0.152: v69.63,32.06 69.63,33.51 70.78,34.65 73.06,34.65 IC5.18 73.14,34.65 v74.13,34.65 | v57.98,27.72 55.92,27.72 IC2.4 | v31.08,51.72 v27.88,54.92 | IC1.4 94.55,24.14 88.76,29.93 86.63,29.93 v83.65,32.9
  Bottom 0.152: v69.63,32.06 62.32,32.06 v57.98,27.72 57.21,26.95 47.16,26.95 46.09,28.02 38.62,28.02 33.44,33.2 33.44,36.02 31.08,38.38 v31.08,51.72 | v27.88,54.92 27.95,54.84 29.17,54.84 X1.18 | v83.65,32.9 80.53,32.9 78.78,34.65 v74.13,34.65
IO4_2  (via drill 0.38)
  Top 0.152: v90.06,35.57 78.55,35.57 78.32,35.34 73.14,35.34 IC5.19 | v93.64,31.98 93.64,31.68 93.18,31.22 93.18,30.76 96,27.95 v96.23,27.95 IC1.7 | v21.93,54.39 19.57,54.39 13.25,60.71 13.25,61.63 12.71,62.16 12.64,62.16 11.87,62.92 11.87,63.38 11.65,63.61 10.73,63.61 v4.18,57.05 | v51.57,13.39 51.57,15.45 51.35,15.68 51.35,27.41 55.38,31.45 55.84,31.45 IC2.7
  Bottom 0.152: v93.64,31.98 v90.06,35.57 | v21.93,54.39 22.01,54.31 29.17,54.31 X1.19 | v4.18,57.05 4.18,6 6.39,3.79 22.92,3.79 25.29,6.15 25.29,10.34 27.65,12.71 41.67,12.71 42.05,12.32 50.51,12.32 v51.57,13.39 51.5,13.24 55.84,8.9 60.57,8.9 61.18,9.51 75.27,9.51 80.38,14.61 80.38,15.07 83.27,17.96 84.65,17.96 94.63,27.95 v96.23,27.95
IO4_3  (via drill 0.38)
  Top 0.152: v63.39,35.26 65.37,35.26 IC5.20 65.44,35.26 v66.43,35.26 | v60.95,32.82 55.92,32.82 IC2.8 | v31.69,49.97 v28.03,53.62 | v31.69,40.82 31.69,34.73 32.07,34.35 32.07,33.97 33.74,32.29 v40.6,32.29 | v93.79,30.99 95.54,29.24 97.75,29.24 IC1.8 | v71.16,36.18 v88.61,36.18
  Bottom 0.152: v63.39,35.26 v60.95,32.82 60.95,32.9 59.5,34.35 42.66,34.35 v40.6,32.29 | v28.03,53.62 28.18,53.78 29.17,53.78 X1.20 | v31.69,49.97 31.69,44.1 31.46,43.87 31.46,41.05 v31.69,40.82 | v88.61,36.18 v93.79,30.99 | v71.16,36.18 69.56,34.57 67.12,34.57 v66.43,35.26
IO4_4  (via drill 0.38)
  Top 0.152: 62.78,34.65 58.74,34.65 57.21,36.18 49.67,36.18 46.96,33.47 | 62.78,34.65 65.37,34.65 IC5.21 | 46.96,33.47 46.32,32.82 45.86,32.82 IC2.13 | v26.2,48.6 27.5,47.3 27.8,47.3 30.77,44.33 30.77,33.97 32.14,32.59 32.98,32.59 33.59,31.98 40.07,31.98 40.37,31.68 v42.89,31.68 | 46.96,33.47 v47.38,33.05 | v82.21,33.51 86.47,29.24 87.69,29.24 IC1.13 | v69.33,36.78 v78.93,36.78 | v66.59,36.78 64.07,36.78 62.78,35.49 62.78,34.65
  Bottom 0.152: v26.2,48.6 26.2,50.96 28.49,53.24 29.17,53.24 X1.21 | v42.89,31.68 46.01,31.68 v47.38,33.05 | v78.93,36.78 v82.21,33.51 | v66.59,36.78 v69.33,36.78
IO4_5  (via drill 0.38)
  Top 0.152: v26.81,49.36 27.19,49.36 32.68,43.87 32.68,34.27 33.74,33.2 43.73,33.2 45.4,31.53 45.78,31.53 IC2.14 45.86,31.53 46.7,31.53 51.04,35.87 57.06,35.87 58.89,34.04 65.37,34.04 IC5.22 65.44,34.04 66.05,34.04 v67.81,35.79 | IC1.14 86.93,27.95 v84.87,30
  Bottom 0.152: v26.81,49.36 26.81,51.03 28.56,52.79 29.17,52.79 X1.22 | v84.87,30 84.87,32.97 80.15,37.7 71.08,37.7 69.18,35.79 v67.81,35.79
IO4_6  (via drill 0.38)
  Top 0.152: 44.6,28.52 45.4,27.72 45.78,27.72 IC2.17 | 44.6,28.52 44.56,28.56 44.56,29.39 44.72,29.55 46.85,29.55 51.96,34.65 56.98,34.65 58.2,33.43 65.37,33.43 IC5.23 65.44,33.43 65.9,33.43 66.36,33.89 v66.74,33.89 | v27.11,48.52 31.08,44.56 31.08,34.5 v31.46,34.12 | v40.3,26.8 41.97,28.48 44.56,28.48 44.6,28.52 | IC1.17 87.31,24.14 84.26,27.18 v84.26,30.61
  Bottom 0.152: v27.11,48.52 27.42,48.82 27.42,51.19 28.49,52.25 29.17,52.25 X1.23 | v31.46,34.12 31.46,31.98 36.64,26.8 v40.3,26.8 | v84.26,30.61 84.26,33.13 80,37.39 73.22,37.39 69.71,33.89 v66.74,33.89
IO4_7  (via drill 0.38)
  Top 0.152: v62.09,32.67 65.37,32.67 IC5.24 | v47.38,27.56 46.24,26.42 IC2.18 45.4,26.42 44.41,27.41 v41.74,27.41 | v27.19,46.23 27.19,37.09 32.3,31.98 v32.75,31.98 | v83.12,30.23 83.12,27.03 87.24,22.92 87.69,22.92 IC1.18
  Bottom 0.152: v47.38,27.56 56.98,27.56 v62.09,32.67 70.47,32.67 71.69,33.89 79.08,33.89 82.74,30.23 v83.12,30.23 | v27.19,46.23 27.72,46.77 27.72,50.96 28.56,51.8 29.17,51.8 X1.24 | v32.75,31.98 34.2,31.98 38.77,27.41 v41.74,27.41
LADC  (via drill 0.38)
  Top 0.152: U$1.P$4 103.7,28.4 102.17,29.93 100.8,29.93 99.73,28.86 99.73,27.79 100.34,27.18 100.34,26.35 R20.1 100.34,26.27 98.89,24.82 95.54,24.82 v91.96,28.4 | v78.55,30.08 73.14,30.08 IC5.11
  Bottom 0.152: v78.55,30.08 81.67,30.08 83.35,28.4 v91.96,28.4
LCLOCK
  Top 0.152: IC1.16 87.77,25.35 88.23,25.35 89.45,24.14 89.45,20.33 84.04,14.92 78.09,14.92 77.71,14.53 77.71,9.05 X2.3
LCLR
  Top 0.152: IC1.19 87.69,21.54 84.26,21.54 76.87,14.15 76.87,9.05 X2.2
LD_/C  (via drill 0.38)
  Top 0.152: v18.5,66.05 24.07,66.05 v30.62,59.49 | IC5.29 65.06,29.47 58.28,22.69 58.28,19.79 56.76,18.27 v56.76,17.96
  Bottom 0.152: 18.5,65.74 18.5,65.05 R47.1 | v30.62,59.49 30.09,59.49 29.93,59.34 29.25,59.34 X1.9 | v56.76,17.96 50.58,17.96 47.31,14.69 38.7,14.69 38.62,14.61 37.33,14.61 33.44,18.5 33.44,23.53 22.39,34.57 18.12,34.57 16.45,36.25 15.53,36.25 10.43,41.36 10.43,57.21 9.28,58.35 9.28,58.81 16.22,65.74 18.5,65.74 | 18.5,65.74 v18.5,66.05
LDIN  (via drill 0.38)
  Top 0.152: v90.06,20.86 90.06,24.82 88.23,26.65 87.77,26.65 IC1.15 | v80.61,10.8 78.93,10.8 78.47,10.34 78.47,9.05 X2.4
  Bottom 0.152: v90.06,20.86 86.09,16.9 86.09,16.29 v80.61,10.8
LEDK1
  Bottom 0.152: R37.2 22.92,53.55 22.92,50.96 23.91,49.97 23.91,49.51 24.75,48.67 24.9,48.67 26.58,47 26.58,46 27.27,45.32 29.17,45.32 X1.37
LEDK2  (via drill 0.38)
  Top 0.152: v12.94,42.96 12.79,43.11 12.79,44.02 R38.2
  Bottom 0.152: v12.94,42.96 16.07,39.83 17.06,39.83 19.95,36.94 25.97,36.94 30.09,41.05 30.09,44.56 29.86,44.79 29.25,44.79 X1.38
LEDK3
  Bottom 0.152: R39.2 29.17,44.33 X1.39
LEDK4
  Bottom 0.152: R40.2 24.37,41.81 26.58,41.81 28.56,43.8 29.17,43.8 X1.40
LHVTRIG  (via drill 0.38)
  Top 0.152: v113.3,33.13 113.3,33.05 110.86,30.61 110.86,28.48 R13.1 | v60.34,9.51 58.36,11.49 58.36,19.41 61.33,22.38 61.33,25.13 64.99,28.78 65.37,28.78 IC5.30
  Bottom 0.152: v113.3,33.13 113.3,37.01 114.36,38.08 114.36,38.54 113.3,39.6 110.17,39.6 107.89,37.32 107.89,36.25 100.19,28.56 94.78,28.56 84.49,18.27 83.12,18.27 80.07,15.22 80.07,14.76 75.12,9.81 60.64,9.81 v60.34,9.51
LLED  (via drill 0.38)
  Top 0.152: R41.1 22.85,39.68 21.02,41.51 20.56,41.51 R43.1 20.49,41.59 20.49,42.73 19.8,43.41 19.8,43.87 v18.81,44.86 | v16.07,40.67 16.68,41.28 16.68,41.51 R42.1 | v14.92,43.26 16.14,43.26 16.9,44.02 R44.1 | v70.24,33.28 70.24,32.97 71.77,31.45 73.06,31.45 IC5.13 | v47.38,35.87 44.72,35.87 42.35,33.51 33.9,33.51 32.98,34.42 32.98,44.02 27.04,49.97 21.78,49.97 v18.35,46.54
  Bottom 0.152: v16.07,40.67 16.07,42.12 15.27,42.92 | v14.92,43.26 15.27,42.92 | v70.24,33.28 66.21,33.28 63.61,35.87 v47.38,35.87 | v18.35,46.54 18.35,46 18.01,45.66 | 15.27,42.92 18.01,45.66 | 18.01,45.66 v18.81,44.86
LRD  (via drill 0.38)
  Top 0.152: IC5.10 71.39,29.47 69.02,31.83 69.02,34.88 v69.33,35.18 | v33.36,31.37 v36.33,31.37 | v32.37,49.43 v30.47,47.53
  Bottom 0.152: 23.08,63.23 25.82,63.23 28.26,60.79 28.26,58.58 28.49,58.35 29.17,58.35 X1.11 | 23.08,63.23 22.54,63.23 18.66,59.34 18.5,59.34 R50.1 | v69.33,35.18 67.35,35.18 66.05,36.48 41.44,36.48 v36.33,31.37 | v33.36,31.37 32.52,31.37 32.07,31.83 32.07,36.94 30.47,38.54 v30.47,47.53 | v32.37,49.43 32.37,54.77 33.06,55.45 33.06,60.79 29.1,64.75 23.46,64.75 23.08,64.37 23.08,63.23
LRESET  (via drill 0.38)
  Top 0.152: v57.37,32.14 58.05,31.45 65.37,31.45 IC5.26 | v41.74,32.59 41.14,32.59 40.83,32.9 33.59,32.9 32.37,34.12 32.37,43.34 v32.07,43.64 | v32.37,48.6 32.98,49.21 32.98,55.15 v32.45,55.68
  Bottom 0.152: v57.37,32.14 49.14,32.14 47.23,34.04 43.19,34.04 v41.74,32.59 | v32.07,43.64 32.07,48.29 v32.37,48.6 | v32.45,55.68 32.45,58.96 31,60.41 29.32,60.41 29.25,60.33 X1.7
LTS+  (via drill 0.38)
  Top 0.152: 97.1,15.56 88.84,7.3 X3.1 | 97.1,15.56 97.14,15.6 97.98,15.6 98.67,14.92 98.82,14.92 R12.2 | v108.34,34.73 125.18,34.73 125.64,34.27 125.64,21.93 121.75,18.04 121.75,9.58 F1.P$4 | v97.07,19.49 97.07,15.6 97.1,15.56
  Bottom 0.152: v108.34,34.73 108.19,34.73 97.07,23.6 v97.07,19.49
LTS-  (via drill 0.38)
  Top 0.152: 97.52,14.15 97.52,14 93.41,9.89 93.41,5.85 X3.2 | 97.52,14.15 97.52,14.84 R12.1 | v105.83,30 109.79,30 112.69,32.9 112.69,33.36 113.75,34.42 125.03,34.42 125.34,34.12 125.34,28.63 121.75,25.05 121.75,19.72 F1.P$3 | v99.5,19.18 99.5,14.31 99.35,14.15 97.52,14.15
  Bottom 0.152: v105.83,30 105.83,28.4 99.5,22.08 v99.5,19.18
LVSEL
  Top 0.152: IC5.14 73.14,32.06 78.02,32.06 78.85,32.9 79.84,32.9 80.07,33.13 80.07,34.73 80.3,34.96 84.49,34.96 87.69,31.76 IC1.11
LWR  (via drill 0.38)
  Top 0.152: v19.34,60.86 19.34,58.2 22.47,55.07 22.54,55.07 | 22.54,55.07 25.97,55.07 27.19,56.29 30.62,56.29 31,56.67 31,57.13 v30.39,57.74 | v66.97,28.78 73.06,28.78 IC5.9 | v56.6,21.09 51.96,16.44 v51.96,15.91 | v26.5,20.55 26.05,20.55 25.13,21.47 25.13,25.74 16.9,33.97 v16.9,40.52 | v19.57,51.19 22.54,54.16 22.54,55.07
  Bottom 0.152: v19.34,60.86 19.04,61.17 18.5,61.17 R49.1 | v30.39,57.74 30.39,58.27 29.93,58.73 29.25,58.73 X1.10 | v66.97,28.78 64.3,28.78 v56.6,21.09 | v51.96,15.91 48.98,15.91 47.46,14.38 38.85,14.38 38.77,14.31 32.75,14.31 v26.5,20.55 | v16.9,40.52 16.9,42.12 19.57,44.79 v19.57,51.19
N$1
  Top 0.152: R1.1 97.83,49.21 97.83,51.42 96.76,52.48 96.76,53.4 97.9,54.54 121.91,54.54 123.28,53.17 123.28,43.41 122.52,42.65 122.52,40.37 122.36,40.21 114.9,40.21 114.67,39.99 112.23,39.99 106.29,34.04 103.16,34.04 103.01,33.89 103.01,30.69 104.84,28.86 104.84,27.49 98.97,21.62 97.83,21.62 IC1.2
N$2
  Top 0.152: R2.1 102.25,35.18 102.25,31.83 99.05,28.63 99.05,26.19 98.29,25.43 97.83,25.43 IC1.5
N$3
  Top 0.152: R3.1 95.92,34.73 93.79,32.59 93.41,32.59 92.88,32.06 92.88,30.46 96.61,26.73 97.75,26.73 IC1.6
N$4
  Top 0.152: R4.1 96,37.7 97.29,36.4 97.9,36.4 99.05,35.26 99.05,31.3 98.29,30.54 97.83,30.54 IC1.9
N$5  (via drill 0.38)
  Top 0.152: v106.59,42.58 106.59,42.8 107.58,43.8 108.88,43.8 109.79,44.71 111.54,44.71 R5.1 | v89.29,30.38 87.85,30.38 IC1.12
  Bottom 0.152: v106.59,42.58 104.84,42.58 94.4,32.14 94.4,30.76 94.02,30.38 v89.29,30.38
N$6
  Top 0.152: T8.1 97.83,59.72 101.33,63.23 104.53,63.23 106.51,61.24 106.51,60.94 108.04,59.42 L3.2 108.12,59.42 109.26,60.56 112.38,60.56 SG1.-
N$7
  Top 0.152: T4.3 108.27,45.09 105.45,42.27 102.55,42.27 101.94,41.66 99.66,41.66 97.29,39.3 97.29,37.78 R4.2
N$8
  Top 0.152: T5.3 113.75,41.28 111.62,43.41 R5.2
N$9
  Top 0.152: 105.68,27.72 105.68,26.95 102.7,23.98 102.7,19.72 F1.P$1 | 105.68,27.72 105.68,28.4 D2.A | 105.68,27.72 118.25,27.72 121.91,31.37 H1.4
N$10
  Top 0.152: T1.1 102.25,52.94 R7.1
N$11  (via drill 0.38)
  Top 0.152: v104.99,45.55 102.02,42.58 101.64,42.58 T2.1 | v105.83,46.69 114.82,46.69 115.51,47.38 119.24,47.38 121.3,49.43 121.3,49.74 R8.1
  Bottom 0.152: v104.99,45.55 104.99,45.85 v105.83,46.69
N$12
  Top 0.152: T3.1 121.98,53.17 121.98,52.33 121.37,51.72 R9.1
N$13
  Top 0.152: T1.3 99.5,49.51 99.2,49.21 R1.2
N$14
  Top 0.152: T2.3 100.72,40.52 100.72,39.83 101.33,39.22 101.33,35.49 101.03,35.18 R2.2
N$15  (via drill 0.38)
  Top 0.152: T3.3 122.97,53.93 125.11,51.8 125.11,35.18 124.96,35.03 117.94,35.03 v117.49,35.49 | v97.29,34.19 97.29,35.18 R3.2
  Bottom 0.152: v117.49,35.49 117.49,35.87 113.45,39.91 103.01,39.91 v97.29,34.19
N$16
  Top 0.152: T4.1 108.04,43.11 110.1,43.11 111.09,44.1 112.69,44.1 115.66,47.07 121.15,47.07 121.3,47.22 R10.1
N$17
  Top 0.152: R7.2 103.62,52.94 103.62,50.65 103.85,50.42 C1.2 110.71,50.42 113.45,47.68 119.09,47.68 120.69,49.28 120.69,50.27 120.92,50.5 122.67,50.5 | 122.67,50.5 122.67,51.64 R9.2 | 122.67,50.5 122.67,49.81 R8.2 122.67,49.74 122.67,47.3 R10.2 122.67,47.22 122.67,44.71 R11.2 122.59,44.71 121.98,44.1 IC7.7
N$18  (via drill 0.38)
  Top 0.152: v107.12,28.4 108.19,28.4 D2.C | 102.02,49.36 102.02,50.42 C1.1 | 102.02,49.36 102.02,46.61 C5.1 | v121.3,43.19 121.3,44.71 R11.1 | v121.3,37.93 121.3,36.94 120.76,36.4 IC7.1 120.69,36.4 119.01,36.4 C6.1 | v110.48,49.36 102.02,49.36
  Bottom 0.152: F1.P$2 101.71,10.5 101.71,22.99 v107.12,28.4 109.11,28.4 110.17,29.47 112.84,29.47 v121.3,37.93 v121.3,43.19 120.99,43.19 114.82,49.36 v110.48,49.36
N$19
  Top 0.152: D1.A 15.15,29.24 14.62,29.24 12.48,31.37 H2.4 5.78,31.37 5.17,30.76 5.17,19.94 F2.P$1
N$20
  Top 0.152: R15.1 8.52,45.55 10.27,45.55 10.58,45.24 11.49,45.24 11.65,45.4 11.65,47.15 11.34,47.45 11.34,48.6 11.49,48.75 13.78,48.75 17.89,44.63 17.89,42.27 18.28,41.89 18.28,39.53 26.2,31.6 26.2,22.08 29.32,18.95 29.32,18.57 31,16.9 34.58,16.9 45.78,5.7 53.94,5.7 56.15,7.9 56.15,18.5 57.98,20.33 57.98,23.98 56.83,25.13 55.92,25.13 IC2.2
N$21
  Top 0.152: R13.2 112.15,28.48 112.15,31.15 114.59,33.58 H1.1
N$22
  Top 0.152: T8.3 96.91,57.66 96.91,60.25 97.83,61.17 R14.2
N$23  (via drill 0.38)
  Top 0.305: v112.08,33.13 103.77,33.13 U$1.P$1 | v113.6,31.6 113.6,30.16 114.59,29.16 H1.3
  Bottom 0.305: v113.6,31.6 v112.08,33.13
N$24  (via drill 0.38)
  Top 0.152: v12.71,49.36 12.71,50.42 R16.1 | v11.04,46.92 9.82,46.92 v9.51,46.61 | v31.76,28.48 v26.81,28.48 | v33.29,28.1 36.87,28.1 v39.99,31.22 | v57.37,29.62 56.53,29.62 55.92,29.01 IC2.5
  Bottom 0.152: v12.71,49.36 12.71,48.6 v11.04,46.92 | v9.51,46.61 9.51,36.86 12.94,33.43 16.98,33.43 19.57,30.84 19.57,30.38 21.48,28.48 v26.81,28.48 | v31.76,28.48 32.91,28.48 v33.29,28.1 | v39.99,31.22 42.51,31.22 42.81,30.92 56.07,30.92 v57.37,29.62
N$25  (via drill 0.38)
  Top 0.152: v8.37,48.6 8.37,49.89 R17.1 | v19.88,26.04 23.46,26.04 v24.52,24.97 | v31.99,17.51 34.43,17.51 45.94,6 51.04,6 52.87,7.83 52.87,8.97 54.32,10.42 55.23,10.42 55.84,11.03 55.84,18.65 57.67,20.48 57.67,23.83 56.91,24.59 54.78,24.59 54.62,24.75 54.62,29.39 55.46,30.23 IC2.6
  Bottom 0.152: v8.37,48.6 8.37,37.55 v19.88,26.04 | v31.99,17.51 v24.52,24.97
N$26  (via drill 0.38)
  Top 0.152: v9.89,58.58 9.06,58.58 8.98,58.65 7.91,58.65 7.76,58.5 v7.76,56.9 | v32.83,21.85 39.99,21.85 v41.36,23.22 | v47.54,25.58 47.54,26.12 55.46,34.04 IC2.9
  Bottom 0.152: R18.1 18.2,57.66 17.28,58.58 v9.89,58.58 | v7.76,56.9 7.76,37.32 19.65,25.43 24.14,25.43 24.3,25.58 29.1,25.58 v32.83,21.85 | v41.36,23.22 41.74,23.22 44.11,25.58 v47.54,25.58
N$27  (via drill 0.38)
  Top 0.152: v12.79,64.06 12.79,65.13 R19.1 | v32.83,22.69 34.73,22.69 43.5,31.45 v43.5,32.59 | v44.34,33.43 45.17,33.43 45.78,34.04 IC2.12
  Bottom 0.152: v12.79,64.06 12.79,62.77 8.98,58.96 8.98,47.99 10.12,46.84 10.12,40.9 19.88,31.15 19.88,30.54 21.32,29.09 27.04,29.09 32.83,23.3 v32.83,22.69 | v44.34,33.43 v43.5,32.59
N$28  (via drill 0.38)
  Top 0.152: v24.22,47.22 19.88,47.22 18.58,45.93 v17.44,45.93 | v16.6,45.09 15.61,44.1 R44.2
  Bottom 0.152: v24.22,47.22 24.52,46.92 24.52,46.23 T13.3 | v16.6,45.09 v17.44,45.93
N$29
  Top 0.152: T6.3 10.96,46 9.21,46 8.9,46.31 7.91,46.31 7.23,45.62 R15.2
N$30
  Top 0.152: T7.3 13.25,53.93 13.09,53.93 11.49,52.33 11.49,50.42 R16.2
N$31
  Top 0.152: T9.3 8.45,56.06 11.26,56.06 11.65,56.44 12.64,56.44 12.79,56.29 12.79,54.69 11.95,53.85 11.95,53.4 9.21,50.65 7.76,50.65 7.07,49.97 R17.2
N$32  (via drill 0.38)
  Top 0.152: v15.38,57.74 13.17,57.74 T10.3
  Bottom 0.152: v15.38,57.74 16.98,57.74 R18.2
N$33
  Top 0.152: T11.3 13.09,62.92 11.49,64.52 11.49,65.13 R19.2
N$35
  Top 0.152: T6.1 11.95,47.99 11.95,45.24 11.49,44.79 11.04,44.79 10.27,44.02 10.27,38.99 R22.1
N$36
  Top 0.152: T7.1 12.26,51.95 12.26,51.03 12.1,50.88 12.1,49.89 9.89,47.68 8.22,47.68 R23.1
N$37
  Top 0.152: T9.1 6.46,56.98 6.46,56.06 7.68,54.84 7.68,52.56 7.07,51.95 R24.1
N$38
  Top 0.152: T10.1 9.74,55.76 8.37,54.39 R25.1
N$39
  Top 0.152: 6.88,50.92 7.23,51.26 7.61,51.26 8.29,51.95 R24.2 | 6.88,50.92 6.39,50.42 6.39,49.43 6.85,48.98 6.85,47.68 R23.2 6.85,47.61 6.85,46.46 4.56,44.18 4.56,41.66 IC8.7 4.56,41.59 4.56,41.05 6.62,38.99 R22.2 8.98,38.99 10.35,37.62 14.01,37.62 | 6.88,50.92 6.39,51.42 6.39,52.48 7,53.09 7,54.31 R25.2 | 14.01,37.62 14.01,36.71 13.78,36.48 C2.2 | 14.01,37.62 14.01,38.99 R26.2
N$40  (via drill 0.38)
  Top 0.152: C8.1 30.16,19.49 30.16,23.91 29.93,24.14 C7.1 29.86,24.14 v27.72,26.27 | 11.87,35.18 11.87,36.4 C2.1 | 11.87,35.18 11.87,35.03 | 11.87,35.03 11.87,33.2 12.18,32.9 12.56,32.9 16.22,29.24 17.67,29.24 D1.C 17.74,29.16 19.04,27.87 v20.26,27.87 | v11.95,38.23 12.71,38.99 R26.1 | 11.87,35.18 v12.03,35.18 11.87,35.03 | 3.68,35.45 4.1,35.03 11.87,35.03 | 3.68,35.45 3.26,35.87 3.26,36.33 IC8.1 | 3.68,35.45 2.43,34.19 2.43,20.94 5.09,18.27 5.09,9.81 F2.P$2
  Bottom 0.152: v11.95,38.23 11.95,35.26 v12.03,35.18 | v27.72,26.27 27.72,26.8 26.66,27.87 v20.26,27.87
N$41
  Bottom 0.152: T12.1 23.61,52.1 23.61,53.02 24.14,53.55 R37.1
N$42  (via drill 0.38)
  Top 0.152: v70.78,20.55 71.54,21.32 R21.2 | v26.81,26.88 v31.92,26.88 | v21.25,26.88 18.2,26.88 16.45,28.63 13.63,28.63 13.17,29.09 H2.1
  Bottom 0.152: v70.78,20.55 64.45,20.55 63.54,19.64 39.15,19.64 v31.92,26.88 | v21.25,26.88 v26.81,26.88
N$43
  Top 0.152: T15.1 11.95,42.73 11.95,43.57 11.49,44.02 R38.1
N$44  (via drill 0.38)
  Top 0.152: v22.16,44.18 21.02,45.32 20.1,45.32 T14.1
  Bottom 0.152: v22.16,44.18 22.85,44.18 23,44.33 R39.1
N$45
  Top 0.152: T5.1 113.14,39.22 113.14,38.08 113.53,37.7 120.23,37.7 121.07,38.54 122.9,38.54 124.5,36.94 124.5,36.4 IC7.4
N$46
  Bottom 0.152: T13.1 23.61,48.21 23.61,44.94 23.69,44.86 23.69,42.42 23.08,41.81 R40.1
N$47
  Top 0.152: T11.1 12.1,60.79 8.98,60.79 3.95,55.76 3.95,39.99 7,36.94 7,36.4 IC8.4
N$48
  Top 0.152: T14.3 19.19,43.26 19.19,41.59 R43.2
N$49  (via drill 0.38)
  Top 0.152: v25.29,49.13 25.29,47.45 24.07,46.23 19.34,46.23 18.2,45.09 18.2,42.42 18.58,42.04 18.58,41.05 20.71,38.92 23.46,38.92 24.14,39.6 R41.2
  Bottom 0.152: v25.29,49.13 24.6,49.81 24.6,50.04 T12.3
N$50
  Top 0.152: T15.3 11.04,40.59 11.8,40.59 12.48,39.91 13.78,39.91 15.38,41.51 R42.2
N$51  (via drill 0.38)
  Top 0.305: v19.57,32.9 23,32.9 U$2.P$1 | v16.29,35.57 15.07,35.57 13.17,33.66 H2.3
  Bottom 0.305: v19.57,32.9 18.96,32.9 v16.29,35.57
RADC  (via drill 0.38)
  Top 0.152: U$2.P$4 27.88,32.82 28.64,32.06 30.54,32.06 R28.1 30.54,31.98 31.92,30.61 v36.87,30.61 | v59.35,30.76 65.37,30.76 IC5.27
  Bottom 0.152: v59.35,30.76 57.59,29.01 44.72,29.01 43.12,30.61 v36.87,30.61
RCLOCK
  Top 0.152: IC2.16 45.86,29.01 46.77,29.01 49.82,32.06 50.28,32.06 50.66,31.68 50.66,29.7 47.08,26.12 47.08,25.96 46.85,25.74 44.72,25.74 44.26,25.28 44.26,21.7 50.2,15.75 50.2,9.05 X4.3
RCLR
  Top 0.152: IC2.19 45.86,25.13 46.32,25.13 50.97,20.48 50.97,9.05 X4.4
RDIN
  Top 0.152: IC2.15 42.89,30.23 39.69,27.03 39.69,25.81 49.36,16.13 49.36,9.05 X4.2
RHVTRIG
  Top 0.152: R21.1 72.91,21.39 72.91,22.38 73.9,23.37 73.9,24.52 73.52,24.9 73.14,24.9 IC5.3
RTS+
  Top 0.152: F2.P$4 28.07,13.66 | 28.07,13.66 28.11,13.7 28.11,14.15 R27.2 | X5.1 39.15,2.49 39.15,3.49 33.13,9.51 33.13,10.42 29.93,13.62 28.11,13.62 28.07,13.66
RTS-
  Top 0.152: F2.P$3 24.22,19.94 28.11,16.06 28.11,15.52 R27.1 28.18,15.45 31.76,15.45 41.36,5.85 43.73,5.85 X5.2
RVSEL
  Top 0.152: IC5.25 65.44,32.14 65.9,32.14 68.41,34.65 68.41,36.02 67.04,37.39 49.75,37.39 47.61,35.26 45.86,35.26 IC2.11
SPKR  (via drill 0.38)
  Top 0.152: v96.3,58.65 96.53,58.88 96.53,61.17 R14.1 | v93.56,33.2 92.57,32.21 v92.57,29.47 | v74.13,30.69 73.22,30.69 73.14,30.76 IC5.12
  Bottom 0.152: v96.3,58.65 96.3,56.75 104.23,48.82 104.23,42.73 94.7,33.2 v93.56,33.2 | v92.57,29.47 92.57,28.17 91.05,26.65 78.17,26.65 v74.13,30.69
TCK  (via drill 0.38)
  Top 0.152: IC5.35 65.44,25.51 65.9,25.51 67.35,24.06 67.35,12.4 67.5,12.25 SV1.3 67.5,12.17 69.25,10.42 72.99,10.42 73.6,11.03 73.6,11.33 80.45,18.19 v80.45,18.57
  Bottom 0.152: v80.45,18.57 84.34,18.57 103.39,37.62 106.97,37.62 S5.4
TDI
  Top 0.152: SV1.5 66.66,16.44 66.66,23.45 65.9,24.21 65.44,24.21 IC5.37
  Bottom 0.152: S7.4 48.76,17.05 50.58,18.88 58.89,18.88 62.4,15.37 62.4,12.25 SV1.5
TDO
  Top 0.152: IC5.38 65.37,23.6 65.37,17.73 59.88,12.25 SV1.6
TEST
  Top 0.152: SV1.1 72.22,12.55 72.22,22.15 73.06,22.99 73.06,23.6 IC5.1
TMS  (via drill 0.38)
  Top 0.152: IC5.36 65.44,24.9 65.82,24.9 66.97,23.75 66.97,14.23 64.99,12.25 SV1.4 64.91,12.17 58.13,5.39 46.85,5.39 45.78,4.32 39.31,4.32 35.65,7.98 35.65,10.57 v32.91,13.32 | v18.96,35.49 21.86,35.49 25.9,31.45 v25.9,21.54
  Bottom 0.152: v18.96,35.49 16.22,38.23 S6.4 | v25.9,21.54 25.9,20.33 v32.91,13.32
VBAT
  Top 0.152: 97.6,44.94 97.6,45.7 98.13,46.23 100.11,46.23 102.25,44.1 R46.2 | 97.6,44.94 97.6,43.8 96,42.19 96,41.59 R45.1 | 97.6,44.94 96.15,44.94 94.86,43.64 94.86,39.91 92.49,37.55 69.25,37.55 68.72,37.01 68.72,33.05 65.82,30.16 65.44,30.16 IC5.28
VCC  (via drill 0.38)
  Top 0.305: v47.84,9.05 48.6,9.05 X4.1 | v72.45,8.51 73.52,9.58 75.5,9.58 76.03,9.05 X2.1 | C10.1 100.57,64.37 105.45,64.37 107.96,61.85 L3.1 108.12,61.85 111.62,61.85 111.77,62.01 117.49,62.01 118.86,60.64 SG1.+ | v118.55,46.46 118.55,43.8 IC3.3 | v105.22,29.32 109.03,29.32 v109.94,28.4
  Bottom 0.305: v47.84,9.05 52.87,9.05 53.4,9.58 54.55,9.58 55.61,8.51 v72.45,8.51 72.53,8.44 72.53,6.99 73.6,5.92 77.18,5.92 85.79,14.53 93.1,14.53 99.12,20.55 99.12,23.22 v105.22,29.32 | SG1.+ 118.55,60.25 v118.55,46.46 118.63,46.39 119.09,46.39 121.98,43.49 121.98,37.62 112.76,28.4 v109.94,28.4
XIN
  Top 0.152: IC5.6 73.14,26.88 76.64,26.88 Q3.2 78.17,28.48 79.16,29.47 79.16,31.37 C12.1
XOUT
  Top 0.152: 78.17,26.65 77.79,26.27 73.14,26.27 IC5.5 | 78.17,26.65 80.68,26.65 C11.1 | 78.17,26.65 Q3.1